# EAGLE schematic keyboard (EAGLE 6.5.0)
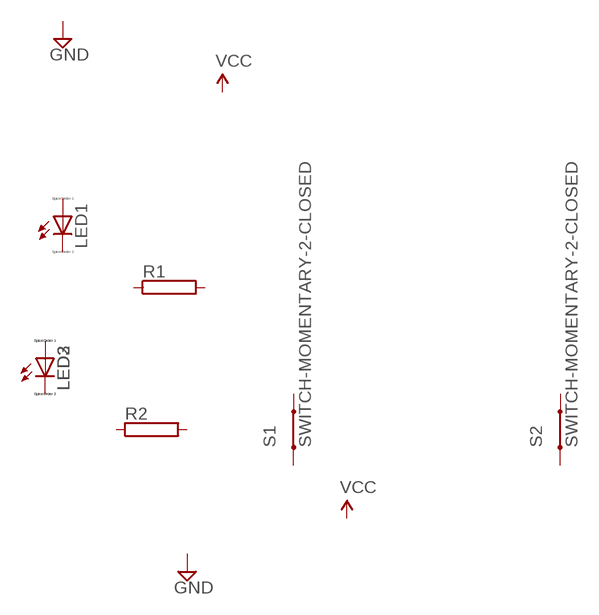
[diagram p0: schematic, sheet 1]

## Parts
LED1  LED_ELD260  [LED_LD260]
LED2  LED_ELD260  [LED_LD260]
LED3  LED_ELD260  [LED_LD260]
R1  RAC01  [AC01]
R2  RAC01  [AC01]
S1  SWITCH-MOMENTARY-2-CLOSED  [TACTILE-PTH-12MM]
S2  SWITCH-MOMENTARY-2-CLOSED  [TACTILE-PTH-12MM]

## Nets
N$1: LED2.A LED3.A
N$2: LED2.K(C) LED3.K(C)
Unconnected: LED1.A LED1.K(C) R1.1 R1.2 R2.1 R2.2 S1.1 S1.3 S2.1 S2.3

## Library data of the parts
LED1-LED3 = eagle-ltspice:LED_E: LED Source: http://www.osram.convergy.de Source: www.luxeon.com Source: www.kingbright.com; SPICEMODEL: NONE; SPICEPREFIX: D; SPICETYPE: diode
R1 R2 = resistor-power:R: Power Resitor; OC_FARNELL: unknown; OC_NEWARK: unknown
S1 S2 = SparkFun-Electromechanical:SWITCH-MOMENTARY-2-CLOSED: Closed Switch for tutorial schematics. Not intended for PCB design. Maps to 12mm tact switch, only because eagle won't place a part with no package defined. The ordinary SWITCH-MOMENTARY-2 is likely to be more useful for regular schematics.